# EAGLE design coax-adapter (EAGLE 8.3.2)
DESIGNER: Jon Newman; DESIGN_NAME: coax-adapter; LICENSE: CERN OHL v1.2; REVISION: 1.0
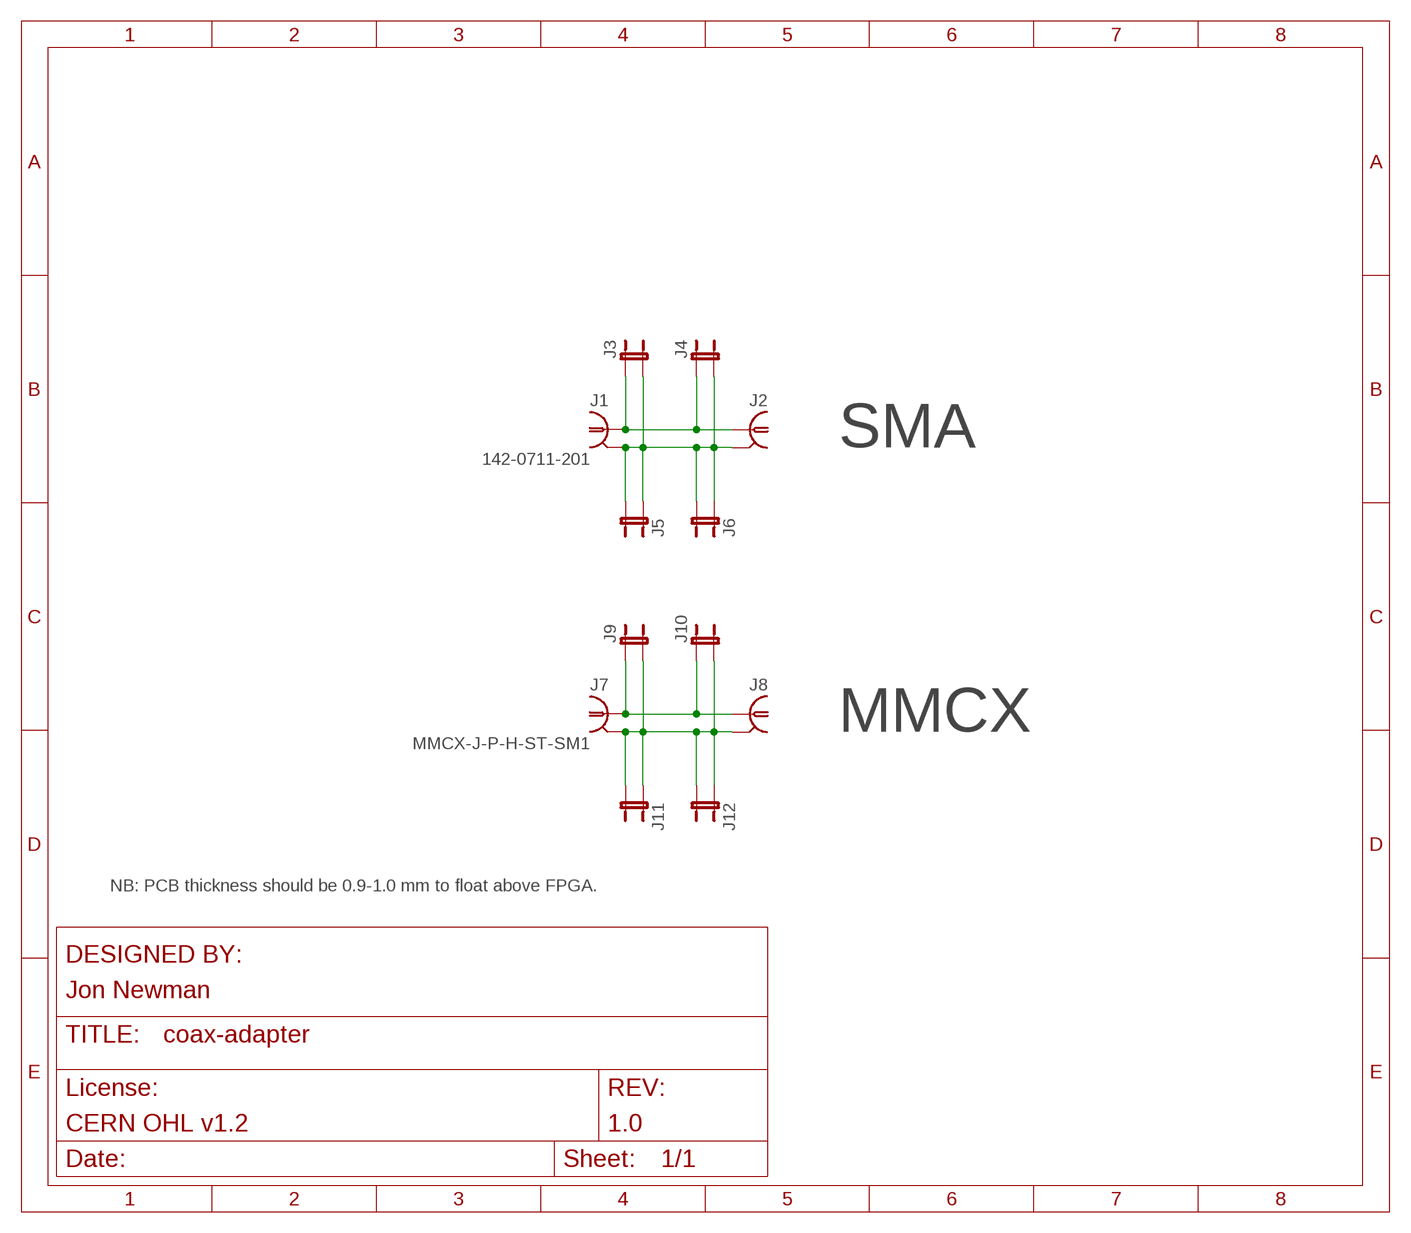
[diagram p0: schematic, sheet 1]

## Parts
J1  142-0711-201  COAX_SMA-VERT-SMA  [SMA_VERT]
J2  COAXCOAX-ADAPTER-8X8MM  [COAX-ADAPTER-8X8MM]
J3  JP2E_COAX-ADAPTER-8X8MM-SIG  [COAX-ADAPTER-8X8MM-SIG]
J4  JP2E_COAX-ADAPTER-8X8MM-SIG  [COAX-ADAPTER-8X8MM-SIG]
J5  JP2E_COAX-ADAPTER-8X8MM-GND  [COAX-ADAPTER-8X8MM-GND]
J6  JP2E_COAX-ADAPTER-8X8MM-GND  [COAX-ADAPTER-8X8MM-GND]
J7  MMCX-J-P-H-ST-SM1  COAX_MMCX-VERT  [MMCX-SMT-VERT]
J8  COAXCOAX-ADAPTER-8X8MM  [COAX-ADAPTER-8X8MM]
J9  JP2E_COAX-ADAPTER-8X8MM-SIG  [COAX-ADAPTER-8X8MM-SIG]
J10  JP2E_COAX-ADAPTER-8X8MM-SIG  [COAX-ADAPTER-8X8MM-SIG]
J11  JP2E_COAX-ADAPTER-8X8MM-GND  [COAX-ADAPTER-8X8MM-GND]
J12  JP2E_COAX-ADAPTER-8X8MM-GND  [COAX-ADAPTER-8X8MM-GND]

## Nets
ADAPT_SIG: J1.SIG J2.SIG J2.SIGPAD J3.SIG J4.SIG J7.SIG J8.SIG J8.SIGPAD J9.SIG J10.SIG
GND: J1.G1 J1.G2 J1.G3 J1.G4 J2.GND1 J2.GND2 J2.GND3 J2.GND4 J3.GND1 J3.GND2 J4.GND1 J4.GND2 J5.GND3 J5.GND4 J6.GND3 J6.GND4 J7.GND@1 J7.GND@2 J7.GND@3 J7.GND@4 J8.GND1 J8.GND2 J8.GND3 J8.GND4 J9.GND1 J9.GND2 J10.GND1 J10.GND2 J11.GND3 J11.GND4 J12.GND3 J12.GND4

## Notes on the sheet
- SMA
- MMCX
- NB: PCB thickness should be 0.9-1.0 mm to float above FPGA.

## Library data of the parts
J1 J2 J7 J8 = jonnew:COAX: COAX CONNECTOR - Edge mount BNC - Vertical BNC - Vertical SMA - etc
J3-J6 J9-J12 = jonnew:JP2E

## Board
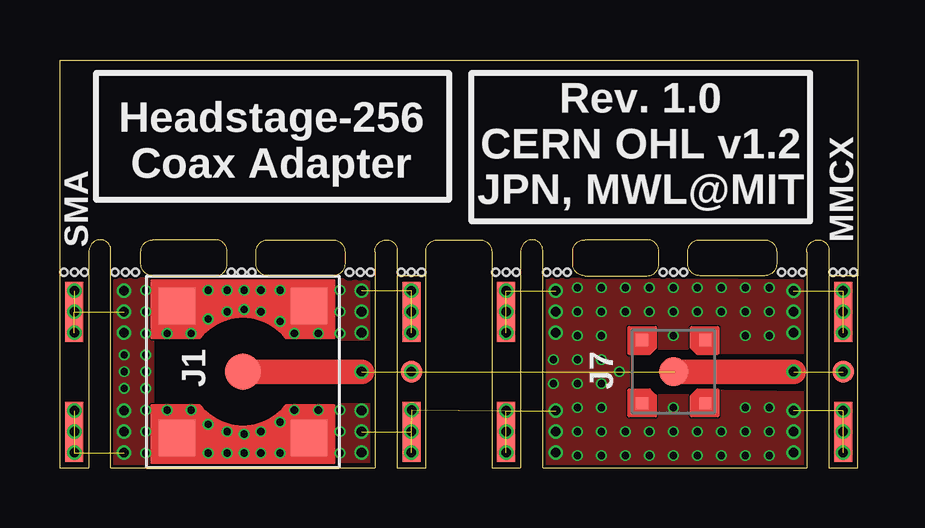
[diagram p1: board, top side]
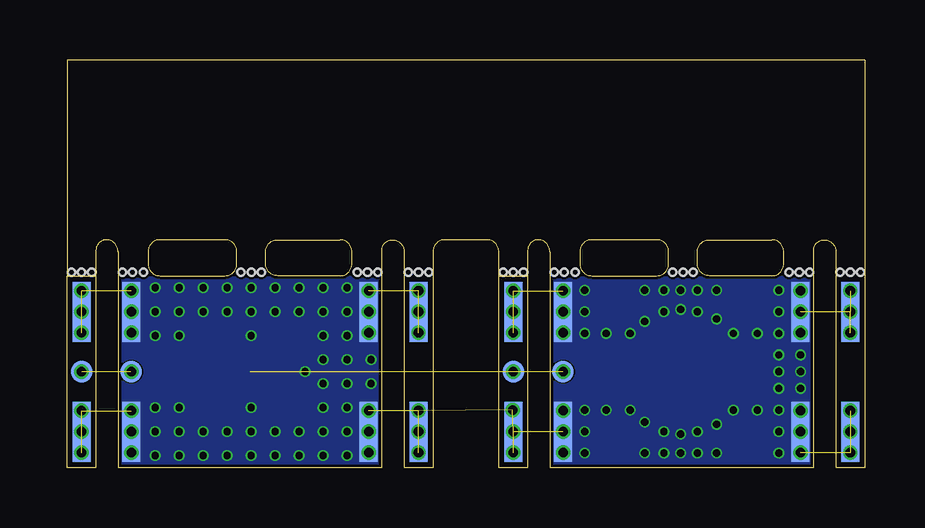
[diagram p2: board, bottom side, seen from below]

Size 33.25 x 17 mm. Coordinates in mm from the lower left corner, seen from the top.
Outline: 15.25,8 14.05,8
Outline: 14.05,8 14.05,0 15.25,0 15.25,8
Outline: 15.25,8 15.25,9 arc-90 15.75,9.5 17.5,9.5 arc-90 18,9 18,0 19.2,0 19.2,9 arc-90 19.7,9.5 arc-90 20.12,9.07 20.12,0 31.12,0 31.12,9 arc-90 31.62,9.5 arc-90 32.05,9.07 32.05,8
Outline: 14.05,8 14.05,9.07 arc90 13.62,9.5 arc90 13.12,9 13.12,0 2.12,0 2.12,9.07 arc90 1.7,9.5 arc90 1.2,9 1.2,0 0,0 0,17 33.25,17 33.25,8
Outline: 33.25,8 32.05,8
Outline: 32.05,8 32.05,0 33.25,0 33.25,8
Outline: 11.88,9 11.88,8.5 arc-90 11.38,8 8.68,8 arc-90 8.18,8.5 8.18,9 arc-90 8.68,9.5 11.38,9.5 arc-90 11.88,9
Outline: 3.88,8 6.47,8 arc90 6.98,8.5 6.98,9 arc90 6.47,9.5 3.88,9.5 arc90 3.38,9 3.38,8.5 arc90 3.88,8
Outline: 29.88,9 29.88,8.5 arc-90 29.38,8 26.68,8 arc-90 26.18,8.5 26.18,9 arc-90 26.68,9.5 29.38,9.5 arc-90 29.88,9
Outline: 21.88,8 24.47,8 arc90 24.97,8.5 24.97,9 arc90 24.47,9.5 21.88,9.5 arc90 21.38,9 21.38,8.5 arc90 21.88,8
Copper layers (1*16): Top 0.036mm / dielectric 4mil / Bottom 0.036mm
Design rules "coax-adapter *": minimum track width 2mil, minimum drill 3mil, track to track 2mil, track to pad 2mil, pad to pad 2mil, via to via 2mil, smd to smd 2mil, copper to edge 5mil, drill to drill 5mil, minimum pad ring 2mil, minimum via ring 2mil, stop-mask expansion 1mil, vias tented up to drill 0.35mm, thermal gap 10mil
Holes 0.3 mm at 0.17,8.15 0.6,8.15 1.03,8.15 2.3,8.15 2.73,8.15 3.15,8.15 7.15,8.15 7.58,8.15 8,8.15 12.07,8.15 12.53,8.15 12.95,8.15 14.23,8.15 14.65,8.15 15.07,8.15 18.18,8.15 18.6,8.15 19.02,8.15 20.3,8.15 20.73,8.15 21.15,8.15 25.15,8.15 25.57,8.15 26,8.15 30.07,8.15 30.52,8.15 30.95,8.15 32.23,8.15 32.65,8.15 33.08,8.15

### Footprints (pad centres in the part's own frame; a part is rotated, then mirrored left to right if it is on the bottom)
SMA_VERT = smd 1.5 x 1.5: G1 -2.75,2.75; G2 -2.75,-2.75; G3 2.75,-2.75; G4 2.75,2.75; SIG 0,0
COAX-ADAPTER-8X8MM = smd 0.75 x 2.5: GND1 4.95,2.5; GND2 4.95,-2.5; GND3 -4.95,-2.5; GND4 -4.95,2.5 | drill 0.4: SIG 4.95,0 | smd 0.9 x 0.9: SIGPAD 4.95,0
COAX-ADAPTER-8X8MM-SIG = smd 0.75 x 2.5: GND1 0,2.5; GND2 0,-2.5 | smd 0.9 x 0.9: SIG 0,0
COAX-ADAPTER-8X8MM-GND = smd 0.75 x 2.5: GND3 0,-2.5; GND4 0,2.5
MMCX-SMT-VERT = smd 0.5 x 0.5: GND@1 -1.325,1.325; GND@2 -1.325,-1.325; GND@3 1.325,-1.325; GND@4 1.325,1.325 | smd 1.2 x 1.2: SIG 0,0

### Placement (x,y rotation side)
J1  7.62,4 90 top
J2  7.62,4 180 bottom
J3  14.65,4 0 bottom
J4  14.65,4 0 top
J5  0.6,4 0 bottom
J6  0.6,4 0 top
J7  25.57,4 0 top
J8  25.62,4 180 bottom
J9  32.65,4 0 bottom
J10  32.65,4 0 top
J11  18.6,4 0 bottom
J12  18.6,4 0 top

### Tracks (layer width: path | path; a pad name or v marks a point on that pad's centre or on a via)
ADAPT_SIG  (via drill 0.4)  (5 unrouted)
  Top 0.8: 12.48,4 12.6,4 | 30.52,4 J8.SIGPAD
  Top 1.016: J1.SIG 12.48,4 | 12.6,4 | 25.62,4 30.52,4 | J8.SIGPAD 30.6,4
  other vias: 14.65,4 32.65,4
GND  (via drill 0.3, 0.4)  (25 unrouted)
  other vias: 14.65,6.5 14.65,7.38 14.65,1.5 14.65,0.62 0.6,7.38 0.6,6.5 0.6,5.62 0.6,2.38 0.6,1.5 0.6,0.62 14.65,5.62 6.98,6.5 9.18,7.4 7.67,7.4 2.67,4.7 5.47,5.6 4.47,5.6 9.18,6.1 6.98,7.4 7.67,6.6 32.65,6.5 32.65,7.38 32.65,2.38 32.65,1.5 32.65,0.62 18.6,7.38 18.6,6.5 18.6,5.62 18.6,2.38 18.6,1.5 18.6,0.62 32.65,5.62 2.67,7.38 2.67,6.5 2.67,5.62 2.67,2.38 2.67,1.5 2.67,0.62 12.57,2.38 12.57,1.5 12.57,0.62 12.57,7.38 12.57,6.5 12.57,5.62 6.18,6.2 6.18,7.4 8.38,7.4 8.38,6.5 3.58,5.6 3.58,7.4 3.58,4.7 3.58,4 2.67,4 2.67,3.3 3.58,3.3 3.58,6.5 9.78,5.6 10.78,5.6 11.68,5.6 11.68,7.4 11.68,6.5 14.68,2.4 30.57,7.38 30.57,6.5 30.57,5.62 30.57,2.38 30.57,1.5 30.57,0.62 20.68,2.38 20.68,1.5 20.68,0.62 20.68,7.38 20.68,6.5 20.68,5.62 6.98,1.5 9.18,0.6 7.67,0.6 5.47,2.4 4.47,2.4 9.18,1.9 6.98,0.6 7.67,1.4 6.18,1.8 6.18,0.6 8.38,0.6 8.38,1.5 3.58,2.4 3.58,0.6 3.58,1.5 9.78,2.4 10.78,2.4 11.68,2.4 11.68,0.6 11.68,1.5 21.57,0.5 22.57,0.5 22.57,1.5 21.57,1.5 21.57,2.5 22.57,2.5 22.57,3.5 21.57,3.5 20.57,3.5 21.57,5.5 22.57,5.5 22.57,6.5 21.57,6.5 21.57,7.5 22.57,7.5 23.57,7.5 24.57,7.5 25.57,7.5 25.57,6.5 26.57,7.5 27.57,7.5 28.57,7.5 28.57,6.5 29.57,6.5 29.57,7.5 29.57,5.5 28.57,5.5 28.57,2.5 29.57,2.5 29.57,1.5 28.57,1.5 28.57,0.5 29.57,0.5 27.57,0.5 26.57,0.5 25.57,0.5 25.57,1.5 24.57,0.5 23.57,0.5 24.57,1.5 23.57,1.5 26.57,1.5 27.57,1.5 25.57,2.5 25.57,5.5 20.57,4.5 21.57,4.5 22.57,4.5 23.57,6.5 24.57,6.5 26.57,6.5 27.57,6.5 23.32,4
  pour Top (no thermals): 2.25,7.88 2.25,0.12 5.88,0.12 5.88,2.62 3.88,2.62 3.88,5.38 5.75,5.38 5.75,7.88
  pour Top (isolate 0.2, no thermals): 9.5,5.38 9.5,7.88 13,7.88 13,5.38
  pour Top (isolate 0.2, no thermals): 9.5,0.12 9.5,2.62 13,2.62 13,0.12
  pour Bottom (rank 2, no thermals): 13.12,8 2.12,8 2.12,0 13.12,0
  pour Top (no thermals): 20.25,7.88 20.25,0.12 30.97,0.02 30.97,3.12 26.57,3.2 26.38,3 24.88,3 24.65,3.23 23.68,3.23 23.68,4.78 24.65,4.78 arc90 24.88,5 26.27,5 26.47,4.8 30.95,4.78 30.95,7.78
  pour Bottom (rank 2, no thermals): 31.12,8 20.12,8 20.12,0 31.12,0

### Text on the board
tPlace: Headstage-256 / Coax Adapter | Rev. 1.0 / CERN OHL v1.2 / JPN, MWL@MIT | MMCX | SMA